# EAGLE schematic TCRT1 (EAGLE 7.2.0)
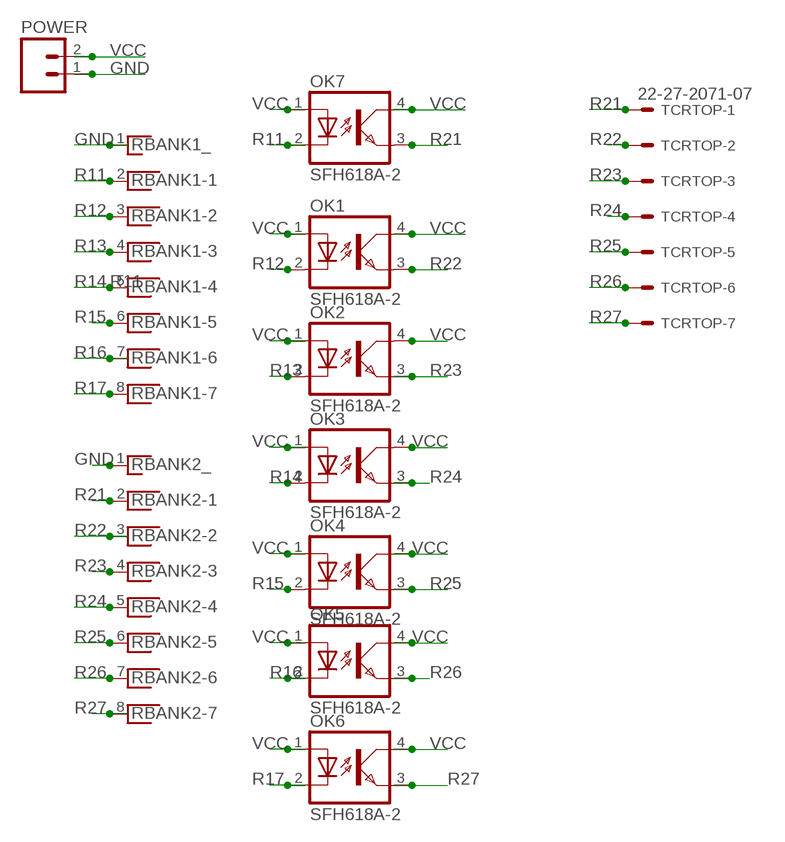
[diagram p0: schematic, sheet 1]

## Parts
OK1  SFH618A-2  [DIP4]
OK2  SFH618A-2  [DIP4]
OK3  SFH618A-2  [DIP4]
OK4  SFH618A-2  [DIP4]
OK5  SFH618A-2  [DIP4]
OK6  SFH618A-2  [DIP4]
OK7  SFH618A-2  [DIP4]
POWER  M025MM  [SCREWTERMINAL-5MM-2]
RBANK1  RNX7  [RN-8]
RBANK2  RNX7  [RN-8]
TCRTOP  22-27-2071-07  [6410-07]

## Nets
GND: POWER.1 RBANK1.1 RBANK2.1
R11: OK7.2(C) RBANK1.2
R12: OK1.2(C) RBANK1.3
R13: OK2.2(C) RBANK1.4
R14: OK3.2(C) RBANK1.5
R15: OK4.2(C) RBANK1.6
R16: OK5.2(C) RBANK1.7
R17: OK6.2(C) RBANK1.8
R21: OK7.3(EMIT) RBANK2.2 TCRTOP.1
R22: OK1.3(EMIT) RBANK2.3 TCRTOP.2
R23: OK2.3(EMIT) RBANK2.4 TCRTOP.3
R24: OK3.3(EMIT) RBANK2.5 TCRTOP.4
R25: OK4.3(EMIT) RBANK2.6 TCRTOP.5
R26: OK5.3(EMIT) RBANK2.7 TCRTOP.6
R27: OK6.3(EMIT) RBANK2.8 TCRTOP.7
VCC: OK1.1(A) OK1.4(COL) OK2.1(A) OK2.4(COL) OK3.1(A) OK3.4(COL) OK4.1(A) OK4.4(COL) OK5.1(A) OK5.4(COL) OK6.1(A) OK6.4(COL) OK7.1(A) OK7.4(COL) POWER.2

## Library data of the parts
OK1-OK7 = optocoupler:SFH618?*: Optocoupler, Phototransistor Output, Low Input Current Source: Data sheet <http://www.vishay.com/docs/83673/sfh618.pdf>; MF: VISHAY/TELEFUNKEN; MPN: SFH618A-2; OC_FARNELL: 6424855; OC_NEWARK: 21H7744
POWER = SparkFun-Connectors:M02: Standard 2-pin 0.1" header. Use with - straight break away headers ( PRT-00116) - right angle break away headers (PRT-00553) - swiss pins (PRT-00743) - machine pins (PRT-00117) - female headers (PRT-00115) Molex polarized connector foot print use with: PRT-08233 with associated crimp pins and housings. 2.54_SCREWTERM for use with PRT-10571. 3.5mm Screw Terminal footprints for PRT-08084 5mm Screw Terminal footprints for use with PRT-08432; STOREFRONT_ID: PRT-08432
RBANK1 RBANK2 = resistor-net:RNX7: RESISTOR NETWORK; OC_FARNELL: unknown; OC_NEWARK: unknown
TCRTOP = con-molex:22-?-07: CONNECTOR wire to board 2.54 mm (.1 inch) pitch header; OC_FARNELL: unknown; OC_NEWARK: unknown